# EAGLE design PoEthernet-Shield-v11 (EAGLE 5.06)

## Sheet 1 of 2
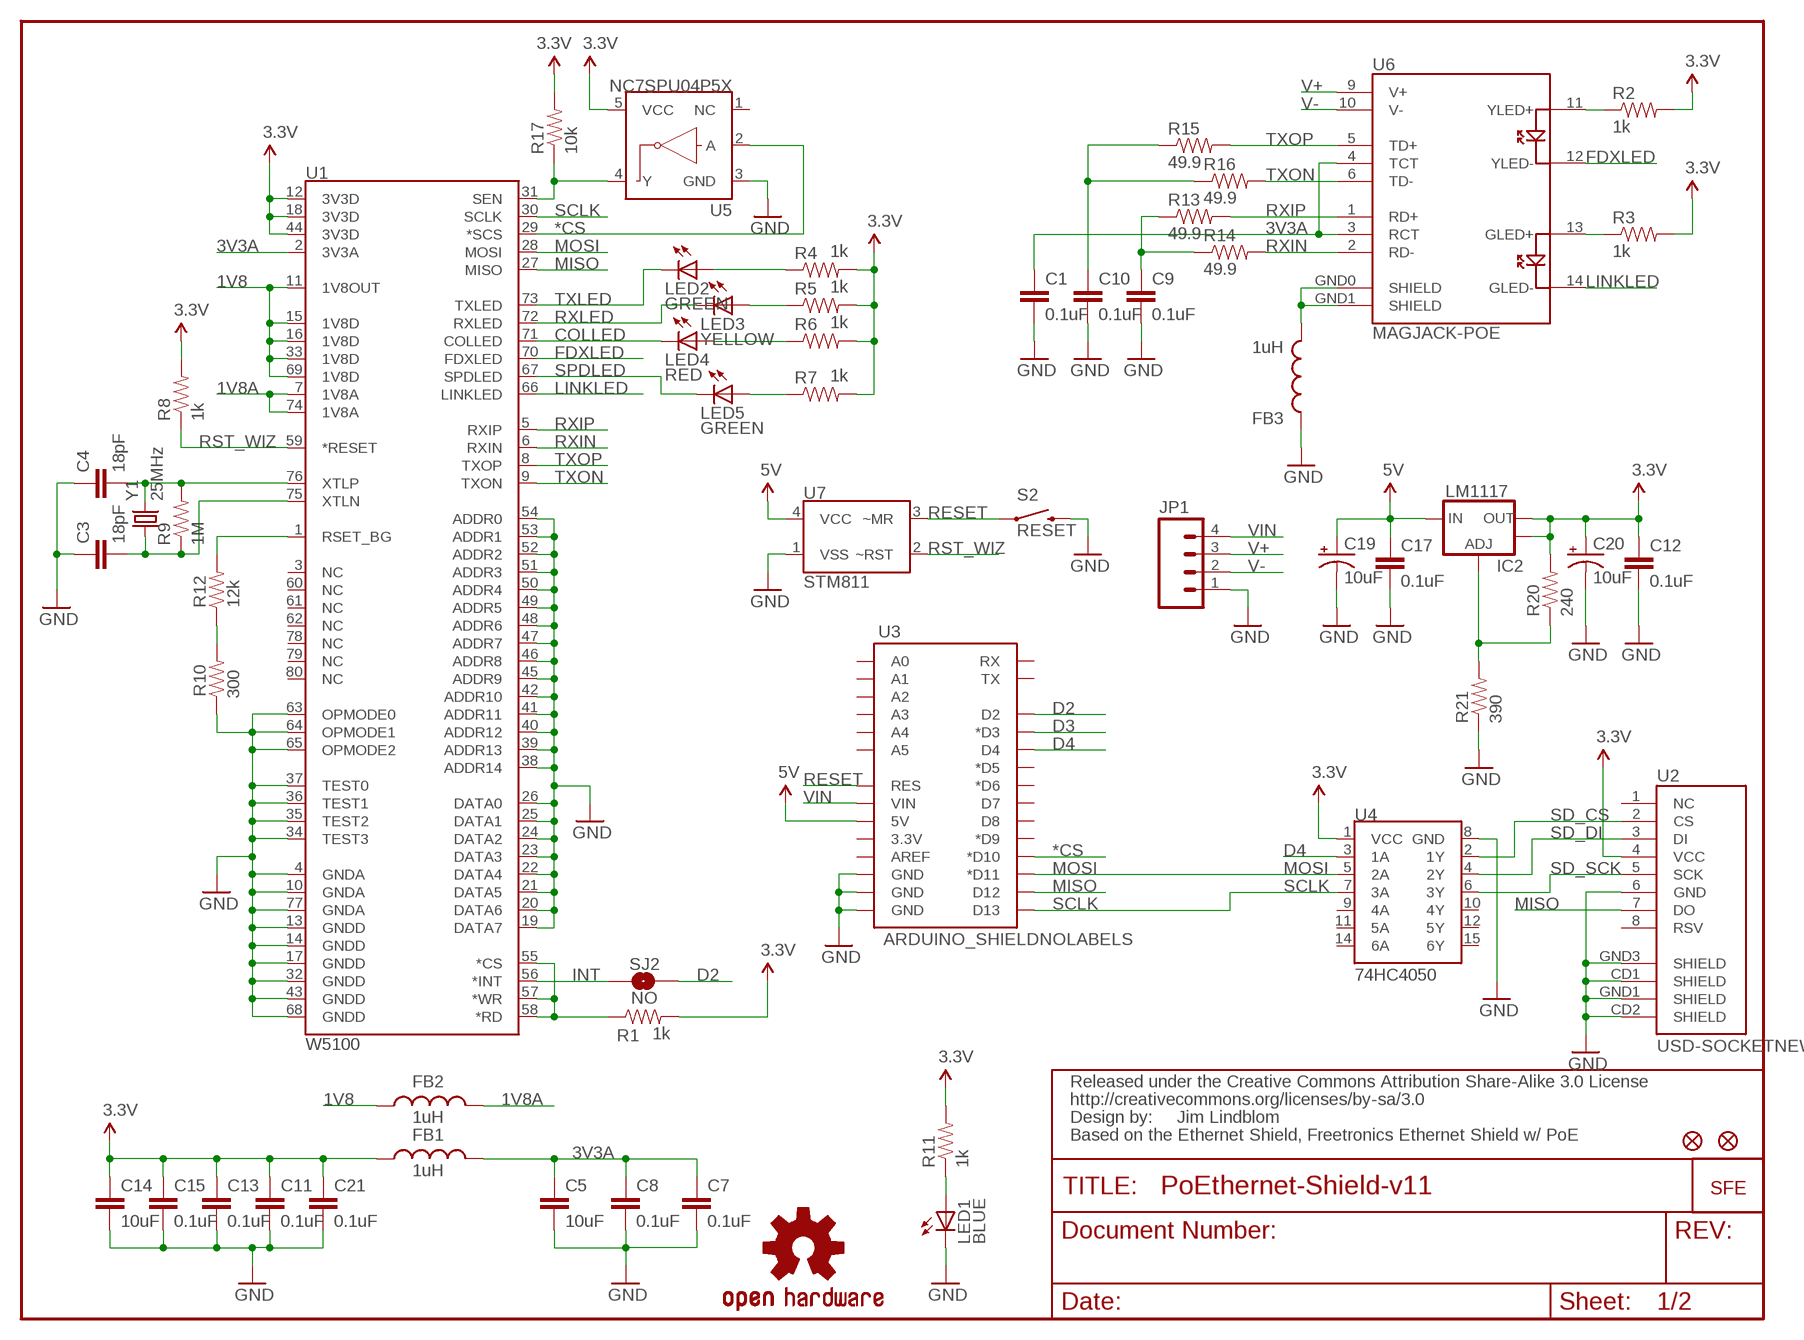
[diagram p0: schematic, sheet 1]

### Parts
C1  0.1uF  CAP0402-CAP  [0402-CAP]
C3  18pF  CAP0402-CAP  [0402-CAP]
C4  18pF  CAP0402-CAP  [0402-CAP]
C5  10uF  CAP1206  [1206]
C7  0.1uF  CAP0402-CAP  [0402-CAP]
C8  0.1uF  CAP0402-CAP  [0402-CAP]
C9  0.1uF  CAP0402-CAP  [0402-CAP]
C10  0.1uF  CAP0402-CAP  [0402-CAP]
C11  0.1uF  CAP0402-CAP  [0402-CAP]
C12  0.1uF  CAP0402-CAP  [0402-CAP]
C13  0.1uF  CAP0402-CAP  [0402-CAP]
C14  10uF  CAP1206  [1206]
C15  0.1uF  CAP0402-CAP  [0402-CAP]
C17  0.1uF  CAP0402-CAP  [0402-CAP]
C19  10uF  CAP_POL1206  [EIA3216]
C20  10uF  CAP_POL1206  [EIA3216]
C21  0.1uF  CAP0402-CAP  [0402-CAP]
FB1  1uH  INDUCTOR0805  [0805]
FB2  1uH  INDUCTOR0805  [0805]
FB3  1uH  INDUCTOR0805  [0805]
IC2  LM1117  V_REG_LM1117SOT223  [SOT223]
JP1  M04PTH  [1X04]
JP2  LOGO-SFENW2  [SFE-NEW-WEB]
JP3  FIDUCIALUFIDUCIAL  [MICRO-FIDUCIAL]
JP4  FIDUCIALUFIDUCIAL  [MICRO-FIDUCIAL]
LED1  BLUE  LED0603  [LED-0603]
LED2  GREEN  LED0603  [LED-0603]
LED3  YELLOW  LED0603  [LED-0603]
LED4  RED  LED0603  [LED-0603]
LED5  GREEN  LED0603  [LED-0603]
R1  1k  RESISTOR0402-RES  [0402-RES]
R2  1k  RESISTOR0402-RES  [0402-RES]
R3  1k  RESISTOR0402-RES  [0402-RES]
R4  1k  RESISTOR0402-RES  [0402-RES]
R5  1k  RESISTOR0402-RES  [0402-RES]
R6  1k  RESISTOR0402-RES  [0402-RES]
R7  1k  RESISTOR0402-RES  [0402-RES]
R8  1k  RESISTOR0402-RES  [0402-RES]
R9  1M  RESISTOR0402-RES  [0402-RES]
R10  300  RESISTOR0402-RES  [0402-RES]
R11  1k  RESISTOR0402-RES  [0402-RES]
R12  12k  RESISTOR0402-RES  [0402-RES]
R13  49.9  RESISTOR0402-RES  [0402-RES]
R14  49.9  RESISTOR0402-RES  [0402-RES]
R15  49.9  RESISTOR0402-RES  [0402-RES]
R16  49.9  RESISTOR0402-RES  [0402-RES]
R17  10k  RESISTOR0402-RES  [0402-RES]
R20  240  RESISTOR0402-RES  [0402-RES]
R21  390  RESISTOR0402-RES  [0402-RES]
S2  RESET  SWITCH-MOMENTARY-2SMD  [TACTILE_SWITCH_SMD]
SJ2  NO  SOLDERJUMPERNO  [SJ_2S-NO]
U1  W5100  [LQFP-80]
U2  USD-SOCKETNEW  [MICRO-SD-SOCKET-PP]
U3  ARDUINO_SHIELDNOLABELS  [DUEMILANOVE_SHIELD_NOLABELS]
U4  74HC4050  HEX_CONVERTER  [SO016]
U5  NC7SPU04P5X  INVERTER""  [SC70]
U6  MAGJACK-POE  [MAGJACK-POE]
U7  STM811  [SOT143]
U$1  CREATIVE_COMMONS  [CREATIVE_COMMONS]
U$5  OSHW-LOGOM  [OSHW-LOGO-M]
Y1  25MHz  CRYSTAL5X3  [CRYSTAL-SMD-5X3]

### Nets
1V8: FB2.1 U1.11(1V8OUT) U1.15(1V8D) U1.16(1V8D) U1.33(1V8D) U1.69(1V8D)
1V8A: FB2.2 U1.7(1V8A) U1.74(1V8A)
3.3V: C11.1 C12.1 C13.1 C14.1 C15.1 C20.A(+) C21.1 FB1.1 IC2.2(OUT) IC2.4(OUT) R1.2 R2.2 R3.2 R4.2 R5.2 R6.2 R7.2 R8.2 R11.2 R17.2 R20.2 U1.12(3V3D) U1.18(3V3D) U1.44(3V3D) U2.4(VCC) U4.1(VCC) U5.5(VCC)
3V3A: C1.1 C5.1 C7.1 C8.1 FB1.2 U1.2(3V3A) U6.3(RCT) U6.4(TCT)
5V: C17.1 C19.A(+) IC2.3(IN) U3.5V U7.4(VCC)
*CS: U1.29(*SCS) U3.D10(*D10) U5.2(A)
CHGND: FB3.2 U6.GND0(SHIELD) U6.GND1(SHIELD)
COLLED: LED4.C U1.71(COLLED)
D2: SJ2.2 U3.D2
D3: U3.D3(*D3)
D4: U3.D4 U4.3(1A)
FDXLED: U1.70(FDXLED) U6.12(YLED-)
GND: C1.2 C3.1 C4.1 C5.2 C7.2 C8.2 C9.2 C10.2 C11.2 C12.2 C13.2 C14.2 C15.2 C17.2 C19.C(-) C20.C(-) C21.2 FB3.1 JP1.1 LED1.C R10.1 R21.1 S2.3 U1.4(GNDA) U1.10(GNDA) U1.13(GNDD) U1.14(GNDD) U1.17(GNDD) U1.19(DATA7) U1.20(DATA6) U1.21(DATA5) U1.22(DATA4) U1.23(DATA3) U1.24(DATA2) U1.25(DATA1) U1.26(DATA0) U1.32(GNDD) U1.34(TEST3) U1.35(TEST2) U1.36(TEST1) U1.37(TEST0) U1.38(ADDR14) U1.39(ADDR13) U1.40(ADDR12) U1.41(ADDR11) U1.42(ADDR10) U1.43(GNDD) U1.45(ADDR9) U1.46(ADDR8) U1.47(ADDR7) U1.48(ADDR6) U1.49(ADDR5) U1.50(ADDR4) U1.51(ADDR3) U1.52(ADDR2) U1.53(ADDR1) U1.54(ADDR0) U1.63(OPMODE0) U1.64(OPMODE1) U1.65(OPMODE2) U1.68(GNDD) U1.77(GNDA) U2.6(GND) U2.CD1(SHIELD) U2.CD2(SHIELD) U2.GND1(SHIELD) U2.GND3(SHIELD) U3.GND@0(GND) U3.GND@1(GND) U3.GND@2(GND) U4.8(GND) U5.3(GND) U7.1(VSS)
INT: SJ2.1 U1.56(*INT)
LINKLED: U1.66(LINKLED) U6.14(GLED-)
MISO: U1.27(MISO) U2.7(DO) U3.D12
MOSI: U1.28(MOSI) U3.D11(*D11) U4.5(2A)
N$1: R2.1 U6.11(YLED+)
N$2: C4.2 R9.2 U1.76(XTLP) Y1.3
N$3: C3.2 R9.1 U1.75(XTLN) Y1.1
N$4: R1.1 U1.55(*CS) U1.57(*WR) U1.58(*RD)
N$5: R3.1 U6.13(GLED+)
N$6: LED1.A R11.1
N$7: C10.1 R15.1 R16.1
N$9: C9.1 R13.1 R14.1
N$10: LED2.A R4.1
N$11: LED3.A R5.1
N$12: LED4.A R6.1
N$13: IC2.1(ADJ) R20.1 R21.2
N$14: LED5.A R7.1
N$15: R10.2 R12.1
RESET: S2.1 U3.RES U7.3(~MR)
RSET_BG: R12.2 U1.1(RSET_BG)
RST_WIZ: R8.1 U1.59(*RESET) U7.2(~RST)
RXIN: R14.2 U1.6(RXIN) U6.2(RD-)
RXIP: R13.2 U1.5(RXIP) U6.1(RD+)
RXLED: LED3.C U1.72(RXLED)
SCLK: U1.30(SCLK) U3.D13 U4.7(3A)
SD_CS: U2.2(CS) U4.2(1Y)
SD_DI: U2.3(DI) U4.4(2Y)
SD_SCK: U2.5(SCK) U4.6(3Y)
SEN: R17.1 U1.31(SEN) U5.4(Y)
SPDLED: LED5.C U1.67(SPDLED)
TXLED: LED2.C U1.73(TXLED)
TXON: R16.2 U1.9(TXON) U6.6(TD-)
TXOP: R15.2 U1.8(TXOP) U6.5(TD+)
V+: JP1.3 U6.9(V+)
V-: JP1.2 U6.10(V-)
VIN: JP1.4 U3.VIN
Unconnected: U1.3(NC) U1.60(NC) U1.61(NC) U1.62(NC) U1.78(NC) U1.79(NC) U1.80(NC) U2.1(NC) U2.8(RSV) U3.3.3V U3.A0 U3.A1 U3.A2 U3.A3 U3.A4 U3.A5 U3.AREF U3.D5(*D5) U3.D6(*D6) U3.D7 U3.D8 U3.D9(*D9) U3.RX U3.TX U4.9(4A) U4.10(4Y) U4.11(5A) U4.12(5Y) U4.14(6A) U4.15(6Y) U5.1(NC)

### Notes on the sheet
- Jim Lindblom
- Based on the Ethernet Shield, Freetronics Ethernet Shield w/ PoE

## Sheet 2 of 2
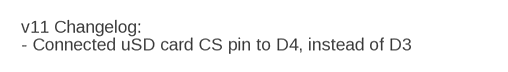
[diagram p1: schematic, sheet 2]

### Notes on the sheet
- v11 Changelog:
- - Connected uSD card CS pin to D4, instead of D3

## Library data of the parts
C1 C3-C5 C7-C15 C17 C21 = SparkFun:CAP: Capacitor Standard 0603 ceramic capacitor, and 0.1" leaded capacitor.
C19 C20 = SparkFun:CAP_POL: Capacitor Polarized These are standard SMD and PTH capacitors. Normally 10uF, 47uF, and 100uF in electrolytic and tantalum varieties. Always verify the external diameter of the through hole cap, it varies with capacity, voltage, and manufacturer. The EIA devices should be standard.
FB1-FB3 = SparkFun:INDUCTOR: Inductors Basic Inductor/Choke - 0603 and 1206. Footprints are not proven and vary greatly between part numbers.
IC2 = SparkFun:V_REG_LM1117: Voltage Regulator LM1117 Standard adjustable voltage regulator but in SMD form. Spark Fun Electronics SKU : COM-00595
JP1 = SparkFun:M04: Header 4 Standard 4-pin 0.1" header. Use with straight break away headers (SKU : PRT-00116), right angle break away headers (PRT-00553), swiss pins (PRT-00743), machine pins (PRT-00117), and female headers (PRT-00115). Molex polarized connector foot print use with SKU : PRT-08231 with associated crimp pins and housings. 1MM SMD Version SKU: PRT-10208
JP2 = SparkFun:LOGO-SFE: Spark Fun Electronics PCB Logo This is the standard Spark Fun Electronics PCB logo.
JP3 JP4 = SparkFun:FIDUCIAL: Fiducial Alignment Points Various fiducial points for machine vision alignment.
LED1-LED5 = SparkFun:LED: LEDs Standard schematic elements and footprints for 5mm, 3mm, 1206, and 0603 sized LEDs. 5mm - Spark Fun Electronics SKU : COM-00529 (and others)
R1-R17 R20 R21 = SparkFun:RESISTOR: Resistor Basic schematic elements and footprints for 0603, 1206, and PTH resistors.
S2 = SparkFun:SWITCH-MOMENTARY-2
SJ2 = SparkFun:SOLDERJUMPER: Solder Jumper Standard SMD solder jumper. Used to automate production. Two varients : Normally Open and Normally Closed are the same, but have different paste layers. NC will have a large amount of paste and should jumper during reflow.
U1 = SparkFun:W5100: WIZnet W5100 TCP/IP PHY Embedded Chip See SparkFun catalog # COM-09471 Package: LQFP-80,10x10mm, 0.4mm pitch
U2 = SparkFun:USD-SOCKET: microSD Socket Push-push type uSD socket. Schematic element and footprint production proven. Spark Fun Electronics SKU : PRT-00127. tDoc lines correctly indicate media card edge positions when inserting (unlocked, locked, depressed).
U3 = SparkFun:ARDUINO_SHIELD
U4 = SparkFun:HEX_CONVERTER
U5 = SparkFun:INVERTER: Single inverter, SOT23-5
U6 = SparkFun:MAGJACK-POE
U7 = SparkFun:STM811
U$1 = SparkFun:CREATIVE_COMMONS
U$5 = SparkFun:OSHW-LOGO: Open Source Hardware Logo This logo indicates the piece of hardware it is found on incorporates a OSHW license and/or adheres to the definition of open source hardware found here: http://freedomdefined.org/OSHW
Y1 = SparkFun:CRYSTAL: Crystals Various standard crystals. Proven footprints. Spark Fun Electronics SKU : COM-00534

## Board
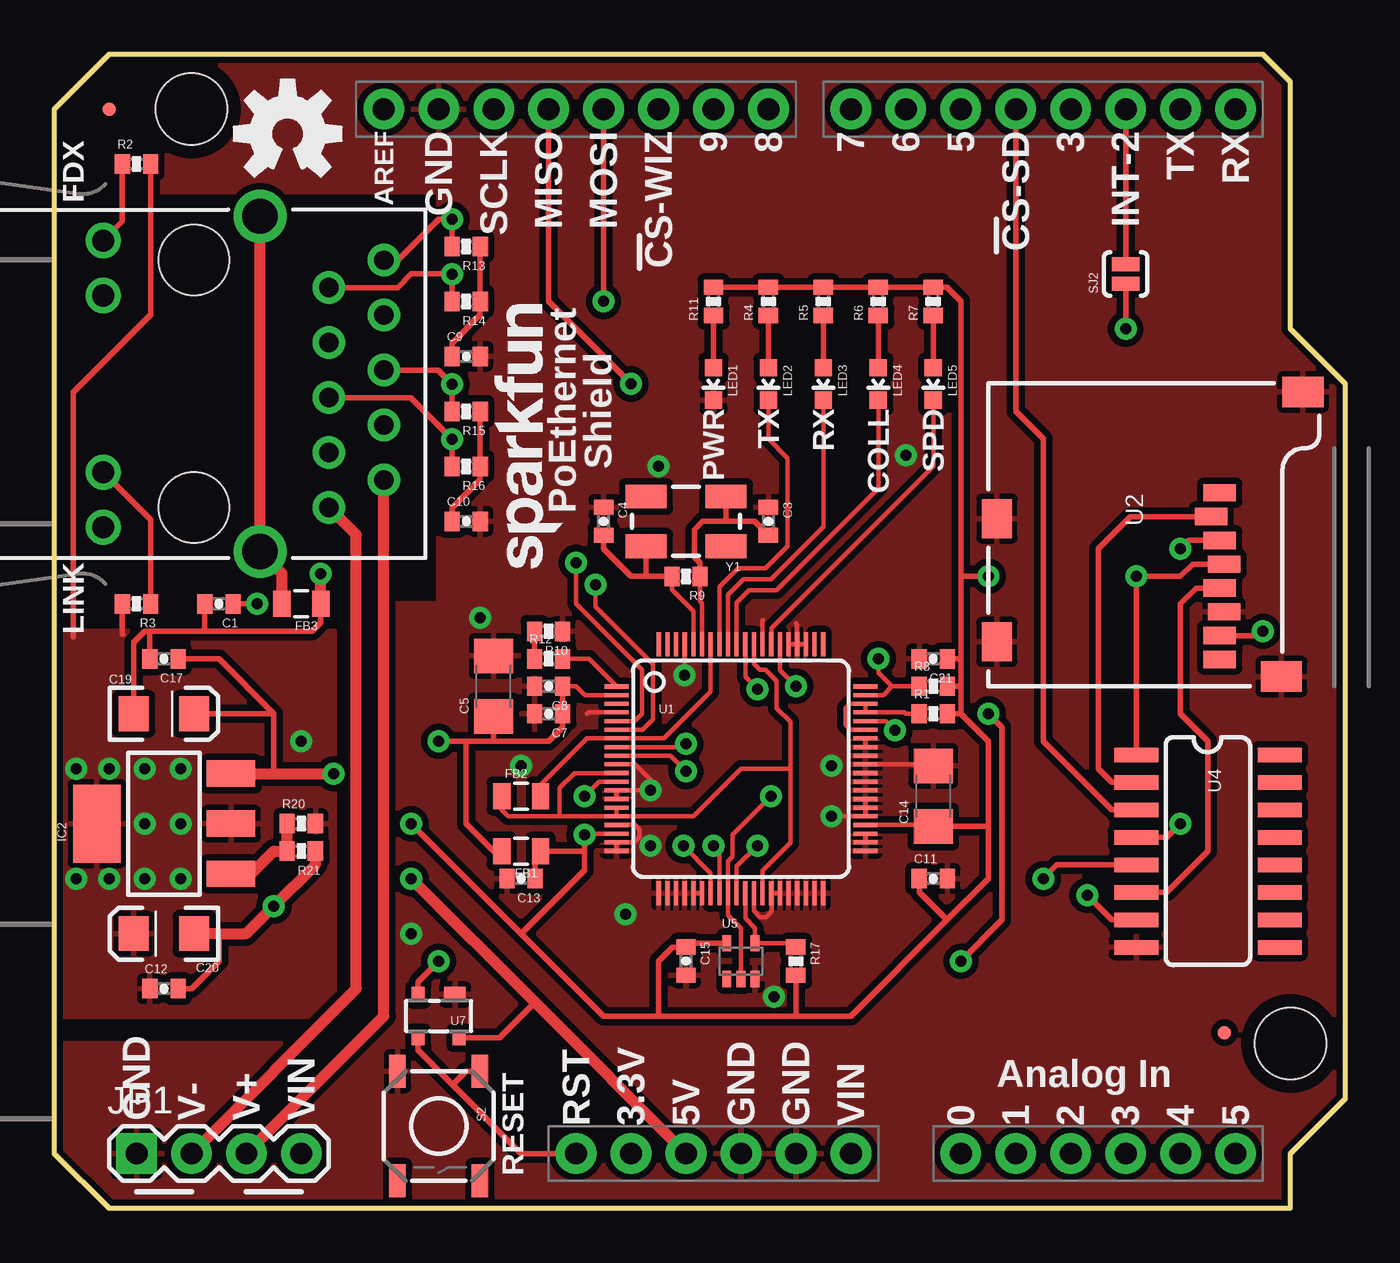
[diagram p2: board, top side]
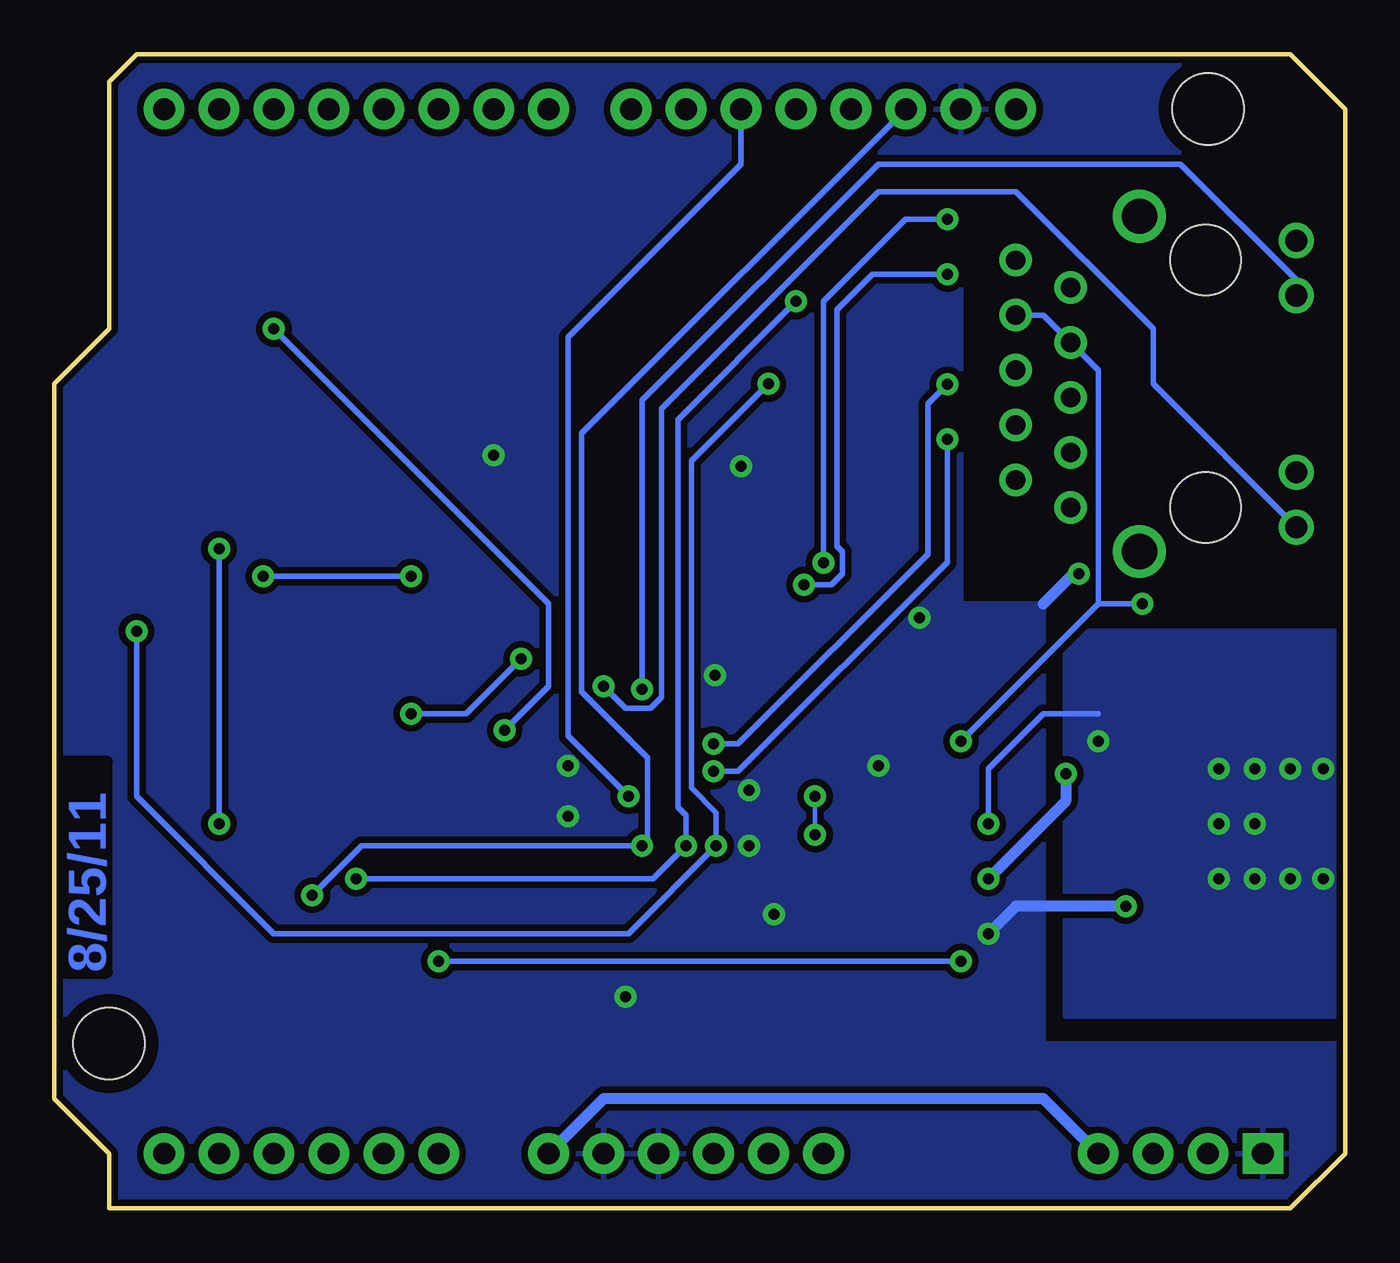
[diagram p3: board, bottom side, seen from below]

Size 59.69 x 53.34 mm. Coordinates in mm from the lower left corner, seen from the top.
Outline: 2.54,0 0,2.54 0,50.8 2.54,53.34 55.88,53.34 57.15,52.07 57.15,40.64 59.69,38.1 59.69,5.08 57.15,2.54 57.15,0 2.54,0
Copper layers (1*16): Top 0.035mm / dielectric 1.5mm / Bottom 0.035mm
Design rules "SparkFun *": minimum track width 8mil, minimum drill 20mil, track to track 8mil, track to pad 8mil, pad to pad 8mil, via to via 8mil, smd to smd 8mil, copper to edge 8mil, drill to drill 8mil, minimum pad ring 12mil, minimum via ring 10mil, stop-mask expansion 4mil, vias tented up to drill 20mil, thermal gap 10mil

### Footprints (pad centres in the part's own frame; a part is rotated, then mirrored left to right if it is on the bottom)
0402-CAP = smd 0.7 x 0.9: 1 -0.65,0; 2 0.65,0
1206 = smd 1.6 x 1.8: 1 -1.4,0; 2 1.4,0
EIA3216 = smd 1.4 x 1.6: A 1.4,0; C -1.4,0
0805 = smd 0.8 x 1.2: 1 -0.9,0; 2 0.9,0
SOT223 = smd 1.219 x 2.235: 1 -2.311,-3.099; 2 0,-3.099; 3 2.311,-3.099 | smd 3.6 x 2.2: 4 0,3.099
1X04 = drill 1.016 pad 1.88 square: 1 0,0 | drill 1.016 pad 1.88 round: 2 2.54,0; 3 5.08,0; 4 7.62,0
MICRO-FIDUCIAL = smd 0.635 x 0.635: 1 0,0
LED-0603 = smd 0.8 x 0.8: A 0,-0.75; C 0,0.75
0402-RES = smd 0.7 x 0.9: 1 -0.65,0; 2 0.65,0
TACTILE_SWITCH_SMD = smd 1.524 x 0.762: 1 -2.54,1.905; 2 2.54,1.905; 3 -2.54,-1.905; 4 2.54,-1.905
SJ_2S-NO = smd 0.635 x 1.27: 1 -0.45,0; 2 0.45,0
LQFP-80 = smd 0.19 x 1.1: 1 -3.8,-5.75; 2 -3.4,-5.75; 3 -3,-5.75; 4 -2.6,-5.75; 5 -2.2,-5.75; 6 -1.8,-5.75; 7 -1.4,-5.75; 8 -1,-5.75; 9 -0.6,-5.75; 10 -0.2,-5.75; 11 0.2,-5.75; 12 0.6,-5.75; 13 1,-5.75; 14 1.4,-5.75; 15 1.8,-5.75; 16 2.2,-5.75; 17 2.6,-5.75; 18 3,-5.75; 19 3.4,-5.75; 20 3.8,-5.75; 41 3.8,5.75; 42 3.4,5.75; 43 3,5.75; 44 2.6,5.75; 45 2.2,5.75; 46 1.8,5.75; 47 1.4,5.75; 48 1,5.75; 49 0.6,5.75; 50 0.2,5.75; 51 -0.2,5.75; 52 -0.6,5.75; 53 -1,5.75; 54 -1.4,5.75; 55 -1.8,5.75; 56 -2.2,5.75; 57 -2.6,5.75; 58 -3,5.75; 59 -3.4,5.75; 60 -3.8,5.75 | smd 1.1 x 0.19: 21 5.75,-3.8; 22 5.75,-3.4; 23 5.75,-3; 24 5.75,-2.6; 25 5.75,-2.2; 26 5.75,-1.8; 27 5.75,-1.4; 28 5.75,-1; 29 5.75,-0.6; 30 5.75,-0.2; 31 5.75,0.2; 32 5.75,0.6; 33 5.75,1; 34 5.75,1.4; 35 5.75,1.8; 36 5.75,2.2; 37 5.75,2.6; 38 5.75,3; 39 5.75,3.4; 40 5.75,3.8; 61 -5.75,3.8; 62 -5.75,3.4; 63 -5.75,3; 64 -5.75,2.6; 65 -5.75,2.2; 66 -5.75,1.8; 67 -5.75,1.4; 68 -5.75,1; 69 -5.75,0.6; 70 -5.75,0.2; 71 -5.75,-0.2; 72 -5.75,-0.6; 73 -5.75,-1; 74 -5.75,-1.4; 75 -5.75,-1.8; 76 -5.75,-2.2; 77 -5.75,-2.6; 78 -5.75,-3; 79 -5.75,-3.4; 80 -5.75,-3.8
MICRO-SD-SOCKET-PP = smd 0.8 x 1.5: 1 -8.94,10.7; 2 -7.84,10.3; 3 -6.74,10.7; 4 -5.64,10.9; 5 -4.54,10.7; 6 -3.44,10.9; 7 -2.34,10.7; 8 -1.24,10.7 | smd 1.8 x 1.4: CD1 -2.05,0.4; CD2 -7.75,0.4 | smd 1.4 x 1.9: GND1 -13.6,14.55; GND3 -0.45,13.55
DUEMILANOVE_SHIELD_NOLABELS = drill 1.016 pad 1.88 round: 3.3V 50.8,26.67; 5V 50.8,29.21; A0 50.8,41.91; A1 50.8,44.45; A2 50.8,46.99; A3 50.8,49.53; A4 50.8,52.07; A5 50.8,54.61; AREF 2.54,15.24; D2 2.54,49.53; D3 2.54,46.99; D4 2.54,44.45; D5 2.54,41.91; D6 2.54,39.37; D7 2.54,36.83; D8 2.54,33.02; D9 2.54,30.48; D10 2.54,27.94; D11 2.54,25.4; D12 2.54,22.86; D13 2.54,20.32; GND@0 50.8,31.75; GND@1 50.8,34.29; GND@2 2.54,17.78; RES 50.8,24.13; RX 2.54,54.61; TX 2.54,52.07; VIN 50.8,36.83 | hole 3.302: 45.72,57.15; 2.54,6.35
SO016 = smd 0.66 x 2.032: 1 -4.445,-3.315; 2 -3.175,-3.315; 3 -1.905,-3.315; 4 -0.635,-3.315; 5 0.635,-3.315; 6 1.905,-3.315; 7 3.175,-3.315; 8 4.445,-3.315; 9 4.445,3.315; 10 3.175,3.315; 11 1.905,3.315; 12 0.635,3.315; 13 -0.635,3.315; 14 -1.905,3.315; 15 -3.175,3.315; 16 -4.445,3.315
SC70 = smd 0.4 x 0.75: 1 -0.65,-0.825; 2 0,-0.825; 3 0.65,-0.825; 4 0.65,0.825; 5 -0.65,0.825
MAGJACK-POE = drill 0.89 round: 1 5.72,-8.89; 2 4.45,-6.35; 3 3.18,-8.89; 4 1.91,-6.35; 5 0.64,-8.89; 6 -0.63,-6.35; 7 -1.9,-8.89; 8 -3.17,-6.35; 9 -4.44,-8.89; 10 -5.71,-6.35 | drill 1.02 round: 11 6.625,4.08; 12 4.085,4.08; 13 -4.085,4.08; 14 -6.625,4.08 | drill 1.63 round: GND0 -7.745,-3.17; GND1 7.745,-3.17 | hole 3.25: -5.715,-0.12; 5.715,-0.12
SOT143 = smd 1 x 0.7: 1 -0.75,-1 | smd 0.6 x 0.7: 2 0.95,-1; 3 0.95,1; 4 -0.95,1
CRYSTAL-SMD-5X3 = smd 1.9 x 1.1: 1 -1.85,-1.15; 2 1.85,-1.15; 3 1.85,1.15; 4 -1.85,1.15

### Placement (x,y rotation side)
C1  7.62,27.94 180 top
C3  33.02,31.75 270 top
C4  25.4,31.75 270 top
C5  20.32,24.13 90 top
C7  22.86,22.86 180 top
C8  22.86,24.13 180 top
C9  19.05,39.37 0 top
C10  19.05,31.75 0 top
C11  40.64,15.24 0 top
C12  5.08,10.16 0 top
C13  21.59,15.24 180 top
C14  40.64,19.05 90 top
C15  29.21,11.43 270 top
C17  5.08,25.4 180 top
C19  5.08,22.86 0 top
C20  5.08,12.7 180 top
C21  40.64,25.4 180 top
FB1  21.59,16.51 180 top
FB2  21.59,19.05 0 top
FB3  11.43,27.94 180 top
IC2  5.08,17.78 90 top
JP1  3.81,2.54 0 top
JP2  23.5,29.59 90 top
JP3  54.1,8.13 0 top
JP4  2.54,50.8 0 top
LED1  30.48,38.1 180 top
LED2  33.02,38.1 180 top
LED3  35.56,38.1 180 top
LED4  38.1,38.1 180 top
LED5  40.64,38.1 180 top
R1  40.64,22.86 0 top
R2  3.81,48.26 0 top
R3  3.81,27.94 180 top
R4  33.02,41.91 90 top
R5  35.56,41.91 90 top
R6  38.1,41.91 90 top
R7  40.64,41.91 90 top
R8  40.64,24.13 0 top
R9  29.21,29.21 180 top
R10  22.86,26.67 180 top
R11  30.48,41.91 90 top
R12  22.86,25.4 0 top
R13  19.05,44.45 180 top
R14  19.05,41.91 180 top
R15  19.05,36.83 180 top
R16  19.05,34.29 180 top
R17  34.29,11.43 270 top
R20  11.43,17.78 0 top
R21  11.43,16.51 180 top
S2  17.78,3.81 270 top
SJ2  49.53,43.18 90 top
U1  31.75,20.32 270 top
U2  43.18,24.13 270 top
U3  0,53.34 270 top
U4  53.34,16.51 270 top
U5  31.75,11.43 0 top
U6  6.35,38.1 90 top
U7  17.78,8.89 180 top
U$1  -6.35,-10.16 0 top  (outside the outline)
U$5  10.79,49.66 0 top
Y1  29.21,31.75 180 top

### Tracks (layer width: path | path; a pad name or v marks a point on that pad's centre or on a via)
1V8
  Top 0.203: 20.69,18.68 FB2.1 20.69,18.43 21,18.12 23.37,18.12 | U1.16 U1.15 | 23.37,18.12 U1.16 | U1.11 24.06,20.12 23.37,19.43 23.37,18.12 | U1.69 32.35,25.18 32.64,24.89 32.89,24.89 33.4,24.38 33.4,23.11 34.04,22.48 34.04,20.32 | U1.33 32.75,15.61 34.04,16.89 34.04,20.32 | U1.16 29.55,18.12 31.75,20.32 34.04,20.32
1V8A
  Top 0.203: U1.74 30.35,23.87 28.2,21.72 U1.7 24.64,21.72 22.49,19.57 FB2.2
3.3V  (via drill 0.51)
  Top 0.203: U1.12 25.18,19.72 v24.51,19.05 | U1.18 24.56,17.32 v24.51,17.27 | U1.44 40.57,17.72 C14.1
  Top 0.254: R3.2 3.16,26.56 3.17,26.54 | R2.2 4.46,41.29 0.89,37.72 0.89,26.42 | U2.4 52.63,29.77 52.07,29.21 v50.02,29.21 | C13.1 22.24,16.26 FB1.1 24.51,16.51 | U5.5 29.39,12.26 C15.1 28.59,12.08 27.94,11.43 27.94,8.89 | 34.29,8.89 R17.2 | 41.91,22.86 R1.2 | 41.91,22.86 43.18,21.59 43.18,17.65 | 43.18,17.65 43.18,15.24 41.27,13.34 | 41.27,13.34 36.83,8.89 34.29,8.89 | C11.1 39.99,14.62 41.27,13.34 | C14.1 43.18,17.65 | 41.91,22.86 41.91,24.13 | 41.91,24.13 41.91,25.4 | 41.91,25.4 41.91,29.21 | 41.91,29.21 41.91,41.91 41.26,42.56 R7.2 R6.2 R5.2 R4.2 R11.2 | 41.91,24.13 R8.2 | 41.91,25.4 C21.1 | v50.02,29.21 U4.1 | 41.91,29.21 v43.18,29.21 | v50.02,29.21 50.02,27.16 | 24.51,16.51 v24.51,17.27 | v16.51,17.78 21.59,12.7 | 27.94,8.89 25.4,8.89 21.59,12.7 | 27.94,8.89 34.29,8.89 | 24.51,16.51 24.51,15.62 21.59,12.7
  Bottom 0.203: v24.51,17.27 v24.51,19.05
  Bottom 0.254: 11.43,22.86 13.97,22.86 16.51,20.32 v16.51,17.78 | v43.18,29.21 v50.02,29.21
  other vias: 4.19,20.32 5.84,20.32 2.54,20.32 2.54,15.24 4.19,17.78 5.84,17.78 1.02,20.32 1.02,15.24 4.19,15.24 5.84,15.24 11.43,21.59
  pour Top (isolate 0.305): 0,8.89 12.95,8.89 12.95,26.67 0,26.67
  pour Bottom (isolate 0.305): 0,8.89 12.95,8.89 12.95,26.67 0,26.67
3V3A  (via drill 0.51)
  Top 0.203: U1.2 24.54,23.72 24.13,24.13 C8.1
  Top 0.254: C8.1 C7.1 23.51,22.24 22.86,21.59 20.32,21.59 | v17.78,21.59 19.05,21.59 | 19.05,21.59 20.32,21.59 | 20.32,21.59 C5.1 | FB1.2 20.32,16.51 19.05,17.78 19.05,21.59 | C1.1 v9.4,27.94
  Bottom 0.254: 11.43,27.94 v17.78,21.59 | U6.3 13.97,41.28 U6.4 11.43,38.74 11.43,27.94 | v9.4,27.94 11.43,27.94
5V  (via drill 0.51)
  Top 0.254: C17.1 7.62,25.4 10.16,22.86 | U7.4 20.59,7.89 22.23,9.53 | 10.16,20.09 10.16,22.86 | 10.16,22.86 C19.A
  Top 0.508: IC2.3 10.16,20.09 v12.93,20.09 | v16.51,15.24 22.23,9.53 U3.5V
  Bottom 0.508: v12.93,20.09 12.93,18.82 v16.51,15.24
*CS  (via drill 0.51)
  Top 0.203: U5.2 31.75,12.95 31.15,13.55 U1.29 31.15,16.04 31.37,16.26 31.37,17.27 v33.15,19.05
  Bottom 0.254: v33.15,19.05 35.94,21.84 35.94,40.26 27.94,48.26 U3.D10
CHGND
  Top 0.508: U6.GND1 U6.GND0 10.53,29.34 FB3.2
COLLED
  Top 0.203: U1.71 31.55,27.99 32.13,28.57 33.4,28.57 38.1,33.27 LED4.C
D2
  Top 0.254: SJ2.2 U3.D2
D4
  Top 0.254: U4.3 48.9,18.41 45.72,21.59 45.72,35.56 44.45,36.83 U3.D4
FDXLED  (via drill 0.51)
  Top 0.203: U1.70 31.95,24.57 v32.51,24
  Bottom 0.254: U6.12 2.27,42.91 7.62,48.26 21.59,48.26 32.51,37.34 v32.51,24
GND  (via drill 0.51)
  Top 0.203: U1.64 U1.65 | U1.4 24.7,22.92 24.64,22.86 | U1.14 U1.13 v27.56,19.32 27.56,19.81 26.85,20.52 U1.10 | U1.20 U1.19 26.83,16.92 27.05,17.14 27.05,17.53 26.86,17.72 U1.17 | U1.25 U1.26 | U1.35 U1.34 33.15,13.71 32.9,13.46 32.64,13.46 32.35,13.75 U1.32 | U1.43 U1.42 | U1.47 U1.45 v35.94,18.12 | U1.53 U1.54 | U1.68 32.75,27.16 32.77,27.18 | U1.64 34.35,26.99 34.29,27.05 | U1.63 U1.64 | v29.15,24.64 U1.77 | U1.51 40.57,20.52 C14.2
  Top 0.254: C19.C 3.68,26.16 4.19,26.67 4.45,26.67 | 4.45,26.67 6.99,26.67 | 6.99,26.67 11.94,26.67 12.33,27.06 FB3.1 | C17.2 4.43,26.66 4.45,26.67 | C1.2 6.97,26.68 6.99,26.67 | C12.2 6.35,10.16 7.62,11.43 7.62,12.7
  Top 0.508: C20.C 7.62,12.7 8.89,12.7 v10.16,13.97 12.08,15.89 R21.1 | FB3.1 v12.33,29.34
  Bottom 0.508: v12.33,29.34 12.57,29.34 13.97,27.94 | v10.16,13.97 15.24,13.97 v16.51,12.7
  other vias: 33.27,9.78 27.56,16.76 35.94,20.45 19.68,27.3 39.37,34.8 27.94,34.29 26.42,13.59 21.59,20.45
  pour Top (isolate 0.305): 0,50.8 2.54,53.34 55.88,53.34 57.15,52.07 57.15,40.64 59.69,38.1 59.69,5.08 57.15,2.54 57.15,0 2.54,0 0,2.54 0,7.62 13.97,7.62 13.97,27.94 17.78,27.94 17.78,46.99 0,46.99
  pour Bottom (isolate 0.305): 0,50.8 2.54,53.34 55.88,53.34 57.15,52.07 57.15,40.64 59.69,38.1 59.69,5.08 57.15,2.54 57.15,0 2.54,0 0,2.54 0,7.62 13.97,7.62 13.97,27.94 17.78,27.94 17.78,46.99 0,46.99
INT  (via drill 0.51)
  Top 0.203: U1.56 38.44,22.52 v38.86,22.1
  Top 0.254: v49.53,40.64 SJ2.1
  Bottom 0.254: v38.86,22.1 36.83,24.13 36.83,27.94 v49.53,40.64
LINKLED  (via drill 0.51)
  Top 0.203: U1.66 33.55,24.87 v34.29,24.13
  Bottom 0.254: U6.14 8.89,38.1 8.89,40.64 15.24,46.99 21.59,46.99 31.62,36.96 31.62,23.62 32.13,23.11 33.27,23.11 v34.29,24.13
MISO  (via drill 0.51)
  Top 0.203: U1.27 30.35,15.5 v29.08,16.76
  Top 0.254: U2.7 55.68,26.47 v55.88,26.67 | U3.D12 22.86,41.91 v26.67,38.1
  Bottom 0.254: v55.88,26.67 55.88,19.05 49.53,12.7 33.15,12.7 v29.08,16.76 29.08,18.29 30.23,19.43 30.23,34.54 v26.67,38.1
MOSI  (via drill 0.51)
  Top 0.203: U1.28 30.75,16.49 v30.48,16.76
  Top 0.254: U4.5 46.35,15.88 v45.72,15.24 | v25.4,41.91 U3.D11
  Bottom 0.254: v25.4,41.91 30.86,36.45 30.86,18.54 30.48,18.16 v30.48,16.76 32,15.24 v45.72,15.24
N$1
  Top 0.254: R2.1 3.16,45.62 U6.11
N$2
  Top 0.203: U1.76 29.55,27.6 28.56,28.59 R9.2
  Top 0.254: 27.3,29.21 26.67,29.21 25.4,30.48 C4.2 | R9.2 27.3,29.21 | Y1.3 27.36,29.27 27.3,29.21
N$3
  Top 0.203: U1.75 29.95,27.96 29.86,28.05 R9.1
  Top 0.254: R9.1 29.86,29.83 29.59,30.1 29.59,31.37 29.97,31.75 31.11,31.75 | Y1.1 31.06,31.8 31.11,31.75 | 31.11,31.75 32.37,31.75 C3.2
N$4
  Top 0.203: U1.55 36.81,22.12 36.58,22.35 36.58,23.11 36.78,23.32 U1.58 U1.57 39.31,22.92 39.37,22.86 R1.1
N$5
  Top 0.254: R3.1 4.46,31.82 U6.13
N$6
  Top 0.254: LED1.A R11.1
N$7
  Top 0.254: R15.1 R16.1 19.7,33.67 18.4,32.37 C10.1
N$9
  Top 0.254: R13.1 R14.1 19.7,41.29 18.4,39.99 C9.1
N$10
  Top 0.254: LED2.A R4.1
N$11
  Top 0.254: LED3.A R5.1
N$12
  Top 0.254: LED4.A R6.1
N$13
  Top 0.508: IC2.1 9.12,15.47 10.16,16.51 R21.2 R20.1
N$14
  Top 0.254: LED5.A R7.1
N$15
  Top 0.254: R10.2 R12.1
RESET
  Top 0.254: U3.RES 21.59,2.54 18.41,5.71 | U7.3 16.83,7.3 18.41,5.71 | S2.1 19.05,6.35 18.41,5.71
RSET_BG
  Top 0.203: R12.2 24.72,25.4 U1.1
RST_WIZ  (via drill 0.51)
  Top 0.203: U1.59 38.33,23.72 38.73,24.13 | 38.73,24.13 R8.1 | v38.1,25.4 38.1,24.77 38.73,24.13
  Top 0.254: v43.18,22.86 43.81,22.23 43.81,13.34 v41.91,11.43 | U7.2 16.83,10.48 v17.78,11.43
  Bottom 0.254: v43.18,22.86 40.64,22.86 v38.1,25.4 | v17.78,11.43 v41.91,11.43
RXIN  (via drill 0.51)
  Top 0.203: U1.6 27.2,22.12 27.69,22.61 27.69,25.15 25.02,27.81 v25.02,28.83
  Top 0.254: R14.2 v18.4,43.16 18.39,43.18 16.51,43.18 15.88,42.55 U6.2
  Bottom 0.254: v25.02,28.83 23.75,28.83 23.24,29.34 23.24,30.35 23.5,30.61 23.5,41.53 21.86,43.16 v18.4,43.16
RXIP  (via drill 0.51)
  Top 0.203: U1.5 26.84,22.52 27.18,22.86 27.18,24.89 24.13,27.94 v24.13,29.84
  Top 0.254: U6.1 15.88,43.82 17.78,45.72 18.39,45.72 v18.4,45.7 R13.2
  Bottom 0.254: v18.4,45.7 20.34,45.7 24.13,41.91 v24.13,29.84
RXLED
  Top 0.203: U1.72 31.15,28.36 31.88,29.08 33.15,29.08 35.56,31.5 LED3.C
SCLK  (via drill 0.51)
  Top 0.203: U1.30 31.55,15.8 v32.51,16.76
  Top 0.254: U4.7 48.9,13.34 v47.75,14.48
  Bottom 0.254: v47.75,14.48 45.47,16.76 v32.51,16.76 32.26,17.02 32.26,20.83 35.31,23.88 35.31,35.81 U3.D13
SD_CS
  Top 0.254: U4.2 48.9,19.68 48.26,20.32 48.26,30.48 49.75,31.97 U2.2
SD_DI  (via drill 0.51)
  Top 0.254: U2.3 52.46,30.87 v52.07,30.48 | v52.07,17.78 51.44,17.14 U4.4
  Bottom 0.254: v52.07,17.78 v52.07,30.48
SD_SCK
  Top 0.254: U4.6 51.44,14.61 53.34,16.51 53.34,21.59 52.07,22.86 52.07,27.94 52.8,28.67 U2.5
SEN
  Top 0.203: U1.31 31.95,13.41 32.4,12.96 U5.4 34.12,12.26 R17.1
SPDLED
  Top 0.203: U1.67 33.15,26.8 40.64,34.29 LED5.C
TXLED
  Top 0.203: U1.73 30.75,28.72 31.62,29.59 32.89,29.59 33.91,30.61 33.91,34.67 33.02,35.56 LED2.C
TXON  (via drill 0.51)
  Top 0.203: U1.9 28.48,20.92 v29.21,20.19
  Top 0.254: v18.4,35.55 18.39,35.56 | U6.6 16.48,37.47 v18.4,35.55 | v18.4,35.55 R16.2
  Bottom 0.254: v29.21,20.19 28.07,20.19 18.4,29.86 v18.4,35.55
TXOP  (via drill 0.51)
  Top 0.203: U1.8 29.07,21.32 v29.21,21.46
  Top 0.254: v18.4,38.09 R15.2 | v18.4,38.09 18.39,38.1 | U6.5 17.75,38.74 v18.4,38.09
  Bottom 0.254: v29.21,21.46 28.07,21.46 19.3,30.23 19.3,37.18 v18.4,38.09
V+
  Top 0.508: U6.9 15.24,8.89 JP1.3
V-
  Top 0.508: U6.10 13.97,31.12 13.97,10.16 JP1.2
VIN
  Bottom 0.508: U3.VIN 34.29,5.08 13.97,5.08 JP1.4

### Text on the board
Bottom: 8/25/11
tPlace: AREF | GND | SCLK | MISO | MOSI | CS-WIZ | 9 | 8 | 7 | 6 | 5 | CS-SD | 3 | INT-2 | TX | RX | FDX | PWR | TX | RX | COLL | SPD | Shield | PoEthernet | LINK | Analog In | GND | V- | V+ | VIN | RST | 3.3V | 5V | GND | GND | VIN | 0 | 1 | 2 | 3 | 4 | 5 | RESET